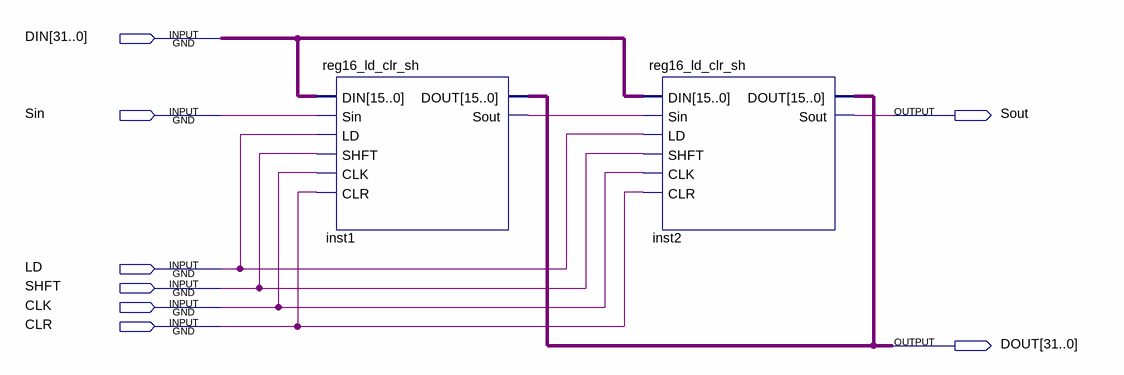
[diagram p0: schematic sheet]
// Quartus schematic reg32_ld_clr_sh.bdf as structural Verilog: 2 symbols, 8 pins
module reg32_ld_clr_sh (
  input  [31:0] DIN,
  input  Sin,
  input  LD,
  input  SHFT,
  input  CLK,
  input  CLR,
  output Sout,
  output [31:0] DOUT
);

  wire inst1_sout;

  reg16_ld_clr_sh inst1 (
    .DIN(DIN[31:16]), .Sin(Sin), .LD(LD), .SHFT(SHFT), .CLK(CLK), .CLR(CLR), .Sout(inst1_sout),
    .DOUT(DOUT[31:16]));
  reg16_ld_clr_sh inst2 (
    .DIN(DIN[15:0]), .Sin(inst1_sout), .LD(LD), .SHFT(SHFT), .CLK(CLK), .CLR(CLR), .Sout(Sout),
    .DOUT(DOUT[15:0]));
endmodule
